# EasyEDA Pro project 差分放大器AD8138.eprj

# Schematic Schematic2
Board Name: AD8138; Create Date: 2025-05-21; Page Name: P1; Project Name: 差分放大器; Schematic Name: Schematic2; Update Date: 2025-05-21; Company: 嘉立创EDA; Page Size: A4; Version: V1.0
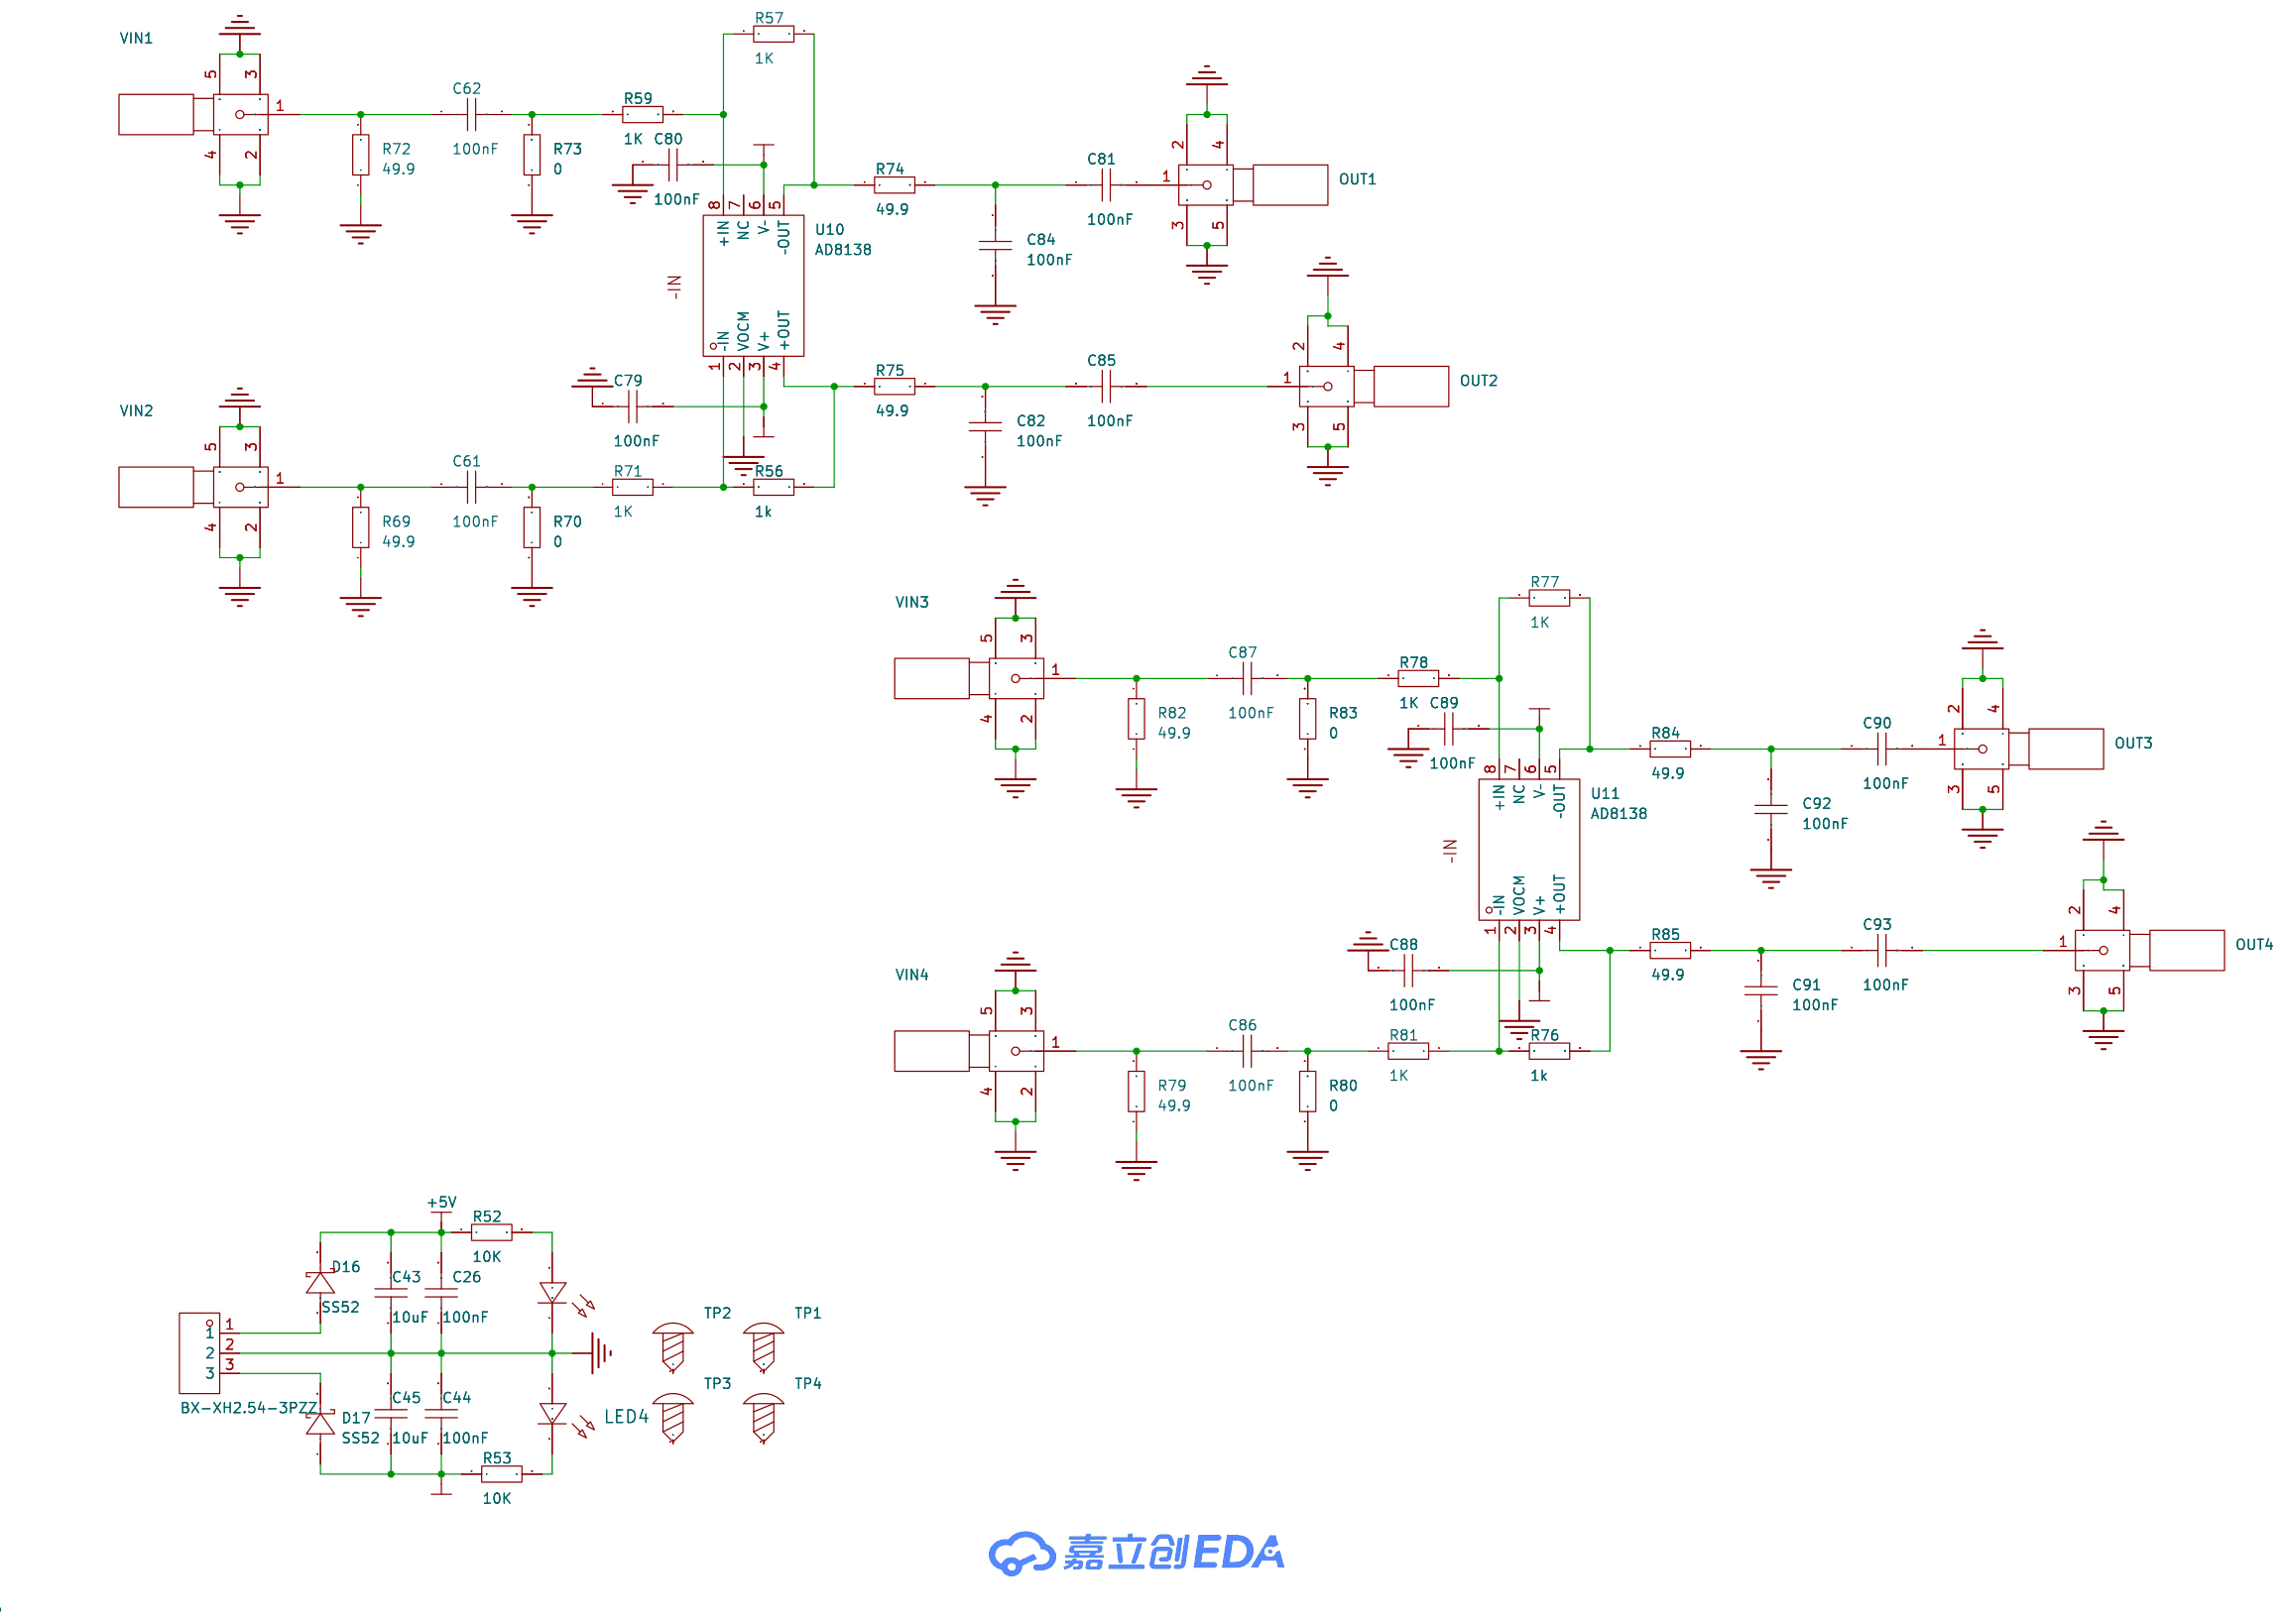
[diagram p0: schematic sheet]

## Parts
C26  100nF  [C0603]
C43  10uF  [C0603]
C44  100nF  [C0603]
C45  10uF  [C0603]
C61  100nF  [C0603]
C62  100nF  [C0603]
C79  100nF  [C0603]
C80  100nF  [C0603]
C81  100nF  [C0603]
C82  100nF  [C0603]
C84  100nF  [C0603]
C85  100nF  [C0603]
C86  100nF  [C0603]
C87  100nF  [C0603]
C88  100nF  [C0603]
C89  100nF  [C0603]
C90  100nF  [C0603]
C91  100nF  [C0603]
C92  100nF  [C0603]
C93  100nF  [C0603]
D16  SS52  [SMA_L4.3-W2.6-LS5.1-R-RD]
D17  SS52  [SMA_L4.3-W2.6-LS5.1-R-RD]
LED3  -  [LED_0603]
LED4  -  [LED_0603]
OUT1  被测信号  [SMA-SMD_SMA-KE]
OUT2  被测信号  [SMA-SMD_SMA-KE]
OUT3  被测信号  [SMA-SMD_SMA-KE]
OUT4  被测信号  [SMA-SMD_SMA-KE]
R52  10K  [R0603]
R53  10K  [R0603]
R56  1k  [R0603]
R57  1K  [R0603]
R59  1K  [R0603]
R69  49.9  [R0603]
R70  0  [R0603]
R71  1K  [R0603]
R72  49.9  [R0603]
R73  0  [R0603]
R74  49.9  [R0603]
R75  49.9  [R0603]
R76  1k  [R0603]
R77  1K  [R0603]
R78  1K  [R0603]
R79  49.9  [R0603]
R80  0  [R0603]
R81  1K  [R0603]
R82  49.9  [R0603]
R83  0  [R0603]
R84  49.9  [R0603]
R85  49.9  [R0603]
TP1  -  [M2螺丝]
TP2  -  [M2螺丝]
TP3  -  [M2螺丝]
TP4  -  [M2螺丝]
U3  BX-XH2.54-3PZZ  [CONN-TH_3P-P2.50_BX-XH2.54-3PZZ]
U10  AD8138  [SOIC-8_L4.9-W3.9-P1.27-LS6.0-BL]
U11  AD8138  [SOIC-8_L4.9-W3.9-P1.27-LS6.0-BL]
VIN1  被测信号  [SMA-SMD_SMA-KE]
VIN2  被测信号  [SMA-SMD_SMA-KE]
VIN3  被测信号  [SMA-SMD_SMA-KE]
VIN4  被测信号  [SMA-SMD_SMA-KE]

## Library data of the parts
C26 C43-C45 C61 C62 C79-C82 C84-C93 = CAP_0603: Supplier Footprint: 0603
D16 D17 = SS52: 二极管配置:独立式;正向压降(Vf):550mV@5A;直流反向耐压(Vr):20V;平均整流电流(Io):5A;; LCSC Part Name: 电压:20V 电流:5A; Supplier Part: C727064; Manufacturer: TWGMC(台湾迪嘉); Supplier Footprint: SMA(DO-214AC); JLCPCB Part Class: 扩展库; Datasheet: https://atta.szlcsc.com/upload/public/pdf/source/20200828/C727064_BD0A2B36CBC76CEA4B6710C57718D41F.pdf; Supplier: LCSC; Diode Configuration: 独立式; Forward Voltage (Vf@If): 550mV@5A; Reverse Voltage (Vr): 20V; Average Rectified Current (Io): 5A; Reverse Leakage Current (Ir): 500uA@20V
LED3 LED4 = LED_0603-R: Supplier Footprint: 0603
OUT1-OUT4 VIN1-VIN4 = SMA-KE_C9900004802: LCSC Part Name: SMA-KE; Supplier Part: C9900004802; Supplier Footprint: SMA-Hole-2Pin; JLCPCB Part Class: 扩展库; Supplier: LCSC
R52 R53 R56 R57 R59 R69-R85 = Res_0603: Supplier Footprint: 0603
TP1-TP4 = M2螺丝: Supplier Footprint: 插件
U3 = BX-XH2.54-3PZZ: 插针结构:1x3P;间距:2.54mm;安装方式:直插;参考系列:XH;总PIN数:3P;排数:1;每排PIN数:3;行距:-;额定电流:3A;触头材质:黄铜;触头镀层:锡;工作温度范围:-25℃~+85℃;; Supplier Part: C18077834; Manufacturer: Bossie(博锡); Supplier Footprint: 插件,P=2.54mm; JLCPCB Part Class: 扩展库; Datasheet: https://atta.szlcsc.com/upload/public/pdf/source/20231017/BF89167887E1F965B2791D14EC788A09.pdf; Supplier: LCSC; Pins Structure: 1x3P; Pitch: 2.54mm; Mounting Style: 直插; Reference Series: XH; Number of Pins: 3P; Number of Rows: 1; Number of PINs Per Row: 3; Current Rating (Max): 3A; Contact Material: 黄铜; Contact Plating: 锡; Operating Temperature Range: -25℃~+85℃
U10 U11 = AD8138: Supplier Part: C9900003414; Supplier Footprint: SOIC-8; JLCPCB Part Class: 扩展库; Supplier: LCSC

## Nets
+5V: C26.2 C43.2 C79.2 C88.2 D16.2(K) R52.1 U10.3(V+) U11.3(V+)
-5V: C44.1 C45.1 C80.2 C89.2 D17.1(A) R53.1 U10.6(V–) U11.6(V–)
GND: C26.1 C43.1 C44.2 C45.2 C79.1 C80.1 C82.1 C84.2 C88.1 C89.1 C91.1 C92.2 LED3.1(C) LED4.2(A) OUT1.2 OUT1.3 OUT1.4 OUT1.5 OUT2.2 OUT2.3 OUT2.4 OUT2.5 OUT3.2 OUT3.3 OUT3.4 OUT3.5 OUT4.2 OUT4.3 OUT4.4 OUT4.5 R69.1 R70.1 R72.1 R73.1 R79.1 R80.1 R82.1 R83.1 U3.2 U10.2(VOCM) U11.2(VOCM) VIN1.2 VIN1.3 VIN1.4 VIN1.5 VIN2.2 VIN2.3 VIN2.4 VIN2.5 VIN3.2 VIN3.3 VIN3.4 VIN3.5 VIN4.2 VIN4.3 VIN4.4 VIN4.5
$1N474: LED4.1(C) R53.2
$1N476: D16.1(A) U3.1
$1N477: D17.2(K) U3.3
$1N479: LED3.2(A) R52.2
$1N1070: C62.2 R59.1 R73.2
$1N1071: C62.1 R72.2 VIN1.1
$1N1075: C61.1 R69.2 VIN2.1
$1N1077: C61.2 R70.2 R71.1
$1N1082: R57.1 R59.2 U10.8(+IN)
$1N1085: R56.1 R71.2 U10.1(–IN)
$1N1088: R57.2 R74.1 U10.5(–OUT)
$1N1090: R56.2 R75.1 U10.4(+OUT)
$1N1450: C81.1 C84.1 R74.2
$1N1458: C82.2 C85.1 R75.2
$1N1560: C81.2 OUT1.1
$1N1714: C85.2 OUT2.1
$1N2634: C90.2 OUT3.1
$1N2638: C93.2 OUT4.1
$1N2641: R77.2 R84.1 U11.5(–OUT)
$1N2642: R77.1 R78.2 U11.8(+IN)
$1N2646: C91.2 C93.1 R85.2
$1N2651: C90.1 C92.1 R84.2
$1N2656: C86.1 R79.2 VIN4.1
$1N2658: C86.2 R80.2 R81.1
$1N2659: C87.2 R78.1 R83.2
$1N2660: C87.1 R82.2 VIN3.1
$1N2661: R76.1 R81.2 U11.1(–IN)
$1N2662: R76.2 R85.1 U11.4(+OUT)

Not connected (* = marked no-connect by the designer): TP1 1; TP2 1; TP3 1; TP4 1; U10 7(NC); U11 7(NC)

# Board PCB2
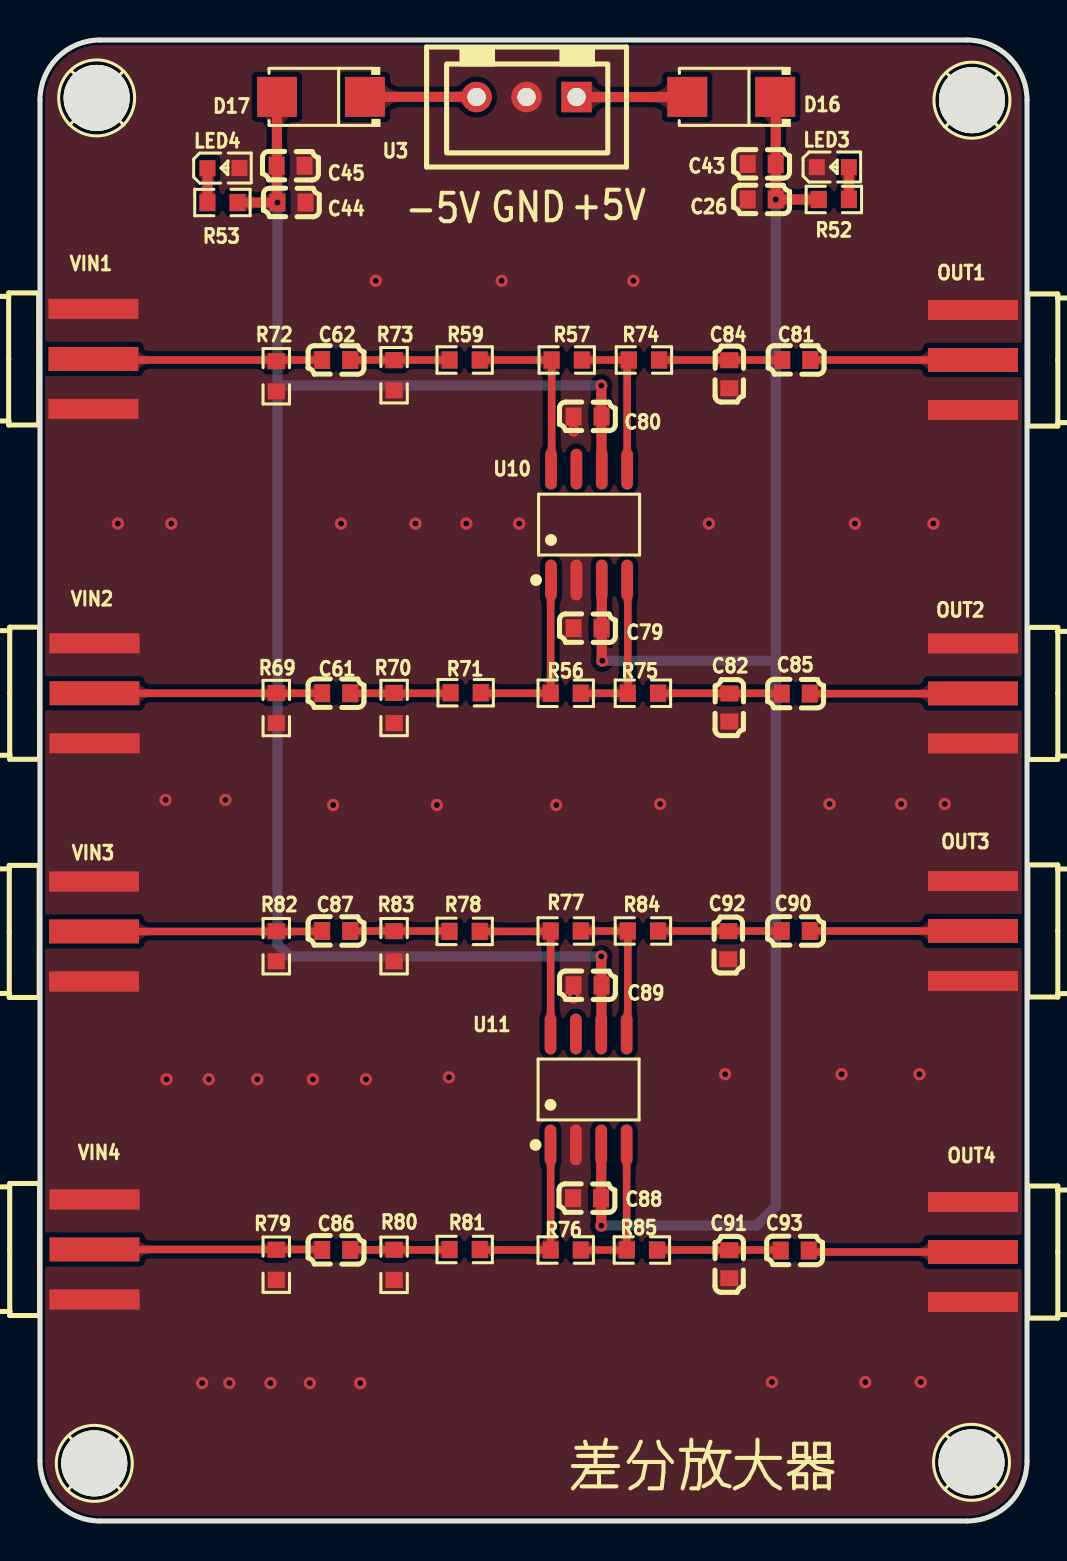
[diagram p1: board, top side]
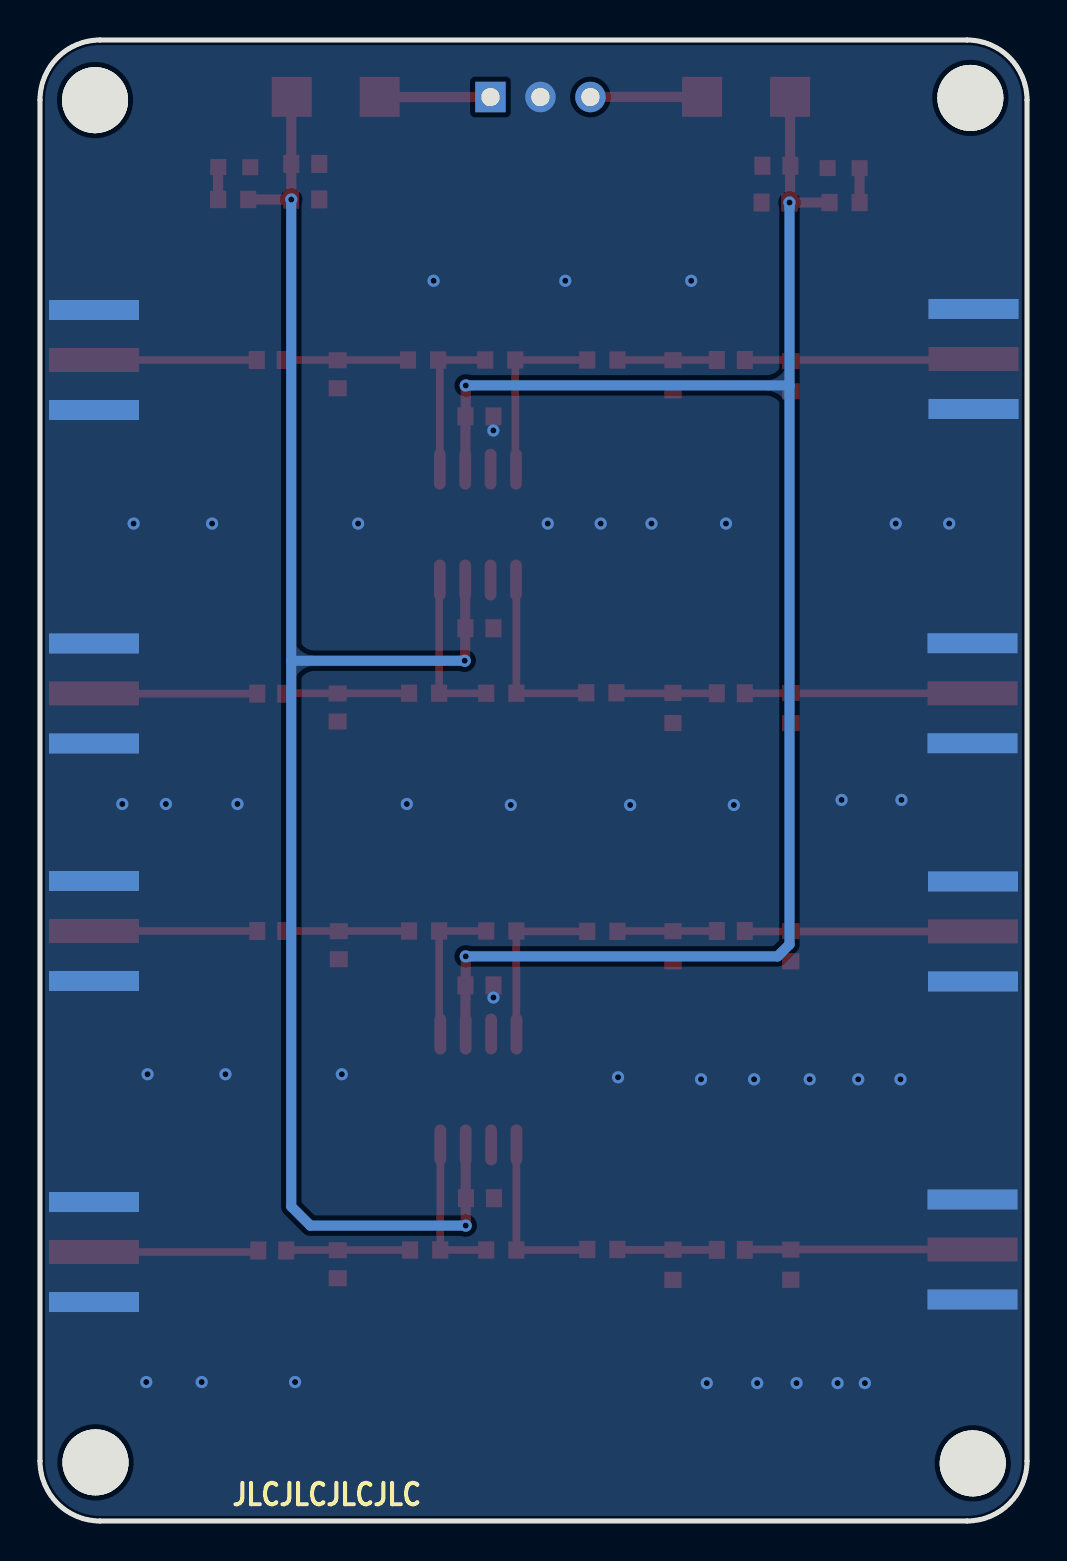
[diagram p2: board, bottom side, seen from below]

Outline 49.37 x 74.05 mm; copper layers: Top Layer, Bottom Layer. Coordinates in mm from the lower left corner of the outline.
Outline path: 0,71.05 0,3 arc(0.88,0.88) 3,0 46.37,0 arc(48.49,0.88) 49.37,3 49.37,71.05 arc(48.49,73.17) 46.37,74.05 3,74.05 arc(0.88,73.17) 0,71.05
Stack: Top Layer 0.035mm / Dielectric1 1.51mm FR4 er 4.5 / Bottom Layer 0.035mm

## Design rules (mm)
net $1N1085: DP1
net $1N1082: DP1
net $1N2661: DP2
net $1N2642: DP2
template: 自定义配置
spacing copperThickness1oz (default): track to track 0.102, other pairs 0.152 to 0.3
spacing copperThickness2oz: track to track 0.203, other pairs 0.152 to 0.3
track width copperThickness1oz (default): min 0.127, default 0.254, max 2.54
track width copperThickness2oz: min 0.203, default 0.254, max 2.54
differential pair differentialPair (default): width min 0.127, default 0.254, max 2.54; gap min 0.152, default 0.152
via viaSize (default): diameter min 0.5, default 0.61, max 10; hole min 0.3, default 0.305, max 6.3

## Placement (name value [footprint] x y rotation side)
C26  100nF  [C0603]  36.1 66.08 0 top
C43  10uF  [C0603]  36.1 67.86 0 top
C44  100nF  [C0603]  12.58 65.93 0 top
C45  10uF  [C0603]  12.54 67.77 0 top
C61  100nF  [C0603]  14.82 41.39 0 top
C62  100nF  [C0603]  14.82 58.05 0 top
C79  100nF  [C0603]  27.39 44.64 0 top
C80  100nF  [C0603]  27.39 55.23 0 top
C81  100nF  [C0603]  37.83 58.05 0 top
C82  100nF  [C0603]  34.48 40.68 90 top
C84  100nF  [C0603]  34.48 57.34 270 top
C85  100nF  [C0603]  37.8 41.37 0 top
C86  100nF  [C0603]  14.82 13.56 0 top
C87  100nF  [C0603]  14.82 29.5 0 top
C88  100nF  [C0603]  27.36 16.14 0 top
C89  100nF  [C0603]  27.39 26.78 0 top
C90  100nF  [C0603]  37.8 29.5 0 top
C91  100nF  [C0603]  34.48 12.84 90 top
C92  100nF  [C0603]  34.42 28.79 270 top
C93  100nF  [C0603]  37.75 13.53 0 top
D16  SS52  [SMA_L4.3-W2.6-LS5.1-R-RD]  34.58 71.21 180 top
D17  SS52  [SMA_L4.3-W2.6-LS5.1-R-RD]  14.05 71.21 180 top
LED3  -  [LED_0603]  39.71 67.7 0 top
LED4  -  [LED_0603]  9.23 67.65 0 top
OUT1  被测信号  [SMA-SMD_SMA-KE]  46.67 58.05 270 top
OUT2  被测信号  [SMA-SMD_SMA-KE]  46.67 41.38 270 top
OUT3  被测信号  [SMA-SMD_SMA-KE]  46.67 29.5 270 top
OUT4  被测信号  [SMA-SMD_SMA-KE]  46.67 13.45 270 top
R52  10K  [R0603]  39.71 66.08 0 top
R53  10K  [R0603]  9.13 65.93 180 top
R56  1k  [R0603]  26.3 41.39 0 top
R57  1K  [R0603]  26.35 58.05 0 top
R59  1K  [R0603]  21.24 58.05 0 top
R69  49.9  [R0603]  11.82 40.65 90 top
R70  0  [R0603]  17.71 40.65 90 top
R71  1K  [R0603]  21.29 41.42 0 top
R72  49.9  [R0603]  11.82 57.24 90 top
R73  0  [R0603]  17.71 57.29 90 top
R74  49.9  [R0603]  30.21 58.05 0 top
R75  49.9  [R0603]  30.16 41.39 0 top
R76  1k  [R0603]  26.3 13.55 0 top
R77  1K  [R0603]  26.3 29.5 0 top
R78  1K  [R0603]  21.24 29.48 0 top
R79  49.9  [R0603]  11.82 12.81 90 top
R80  0  [R0603]  17.71 12.81 90 top
R81  1K  [R0603]  21.24 13.58 0 top
R82  49.9  [R0603]  11.82 28.74 90 top
R83  0  [R0603]  17.71 28.74 90 top
R84  49.9  [R0603]  30.16 29.5 0 top
R85  49.9  [R0603]  30.11 13.55 0 top
TP1  -  [M2螺丝]  46.59 2.93 0 top
TP2  -  [M2螺丝]  2.72 2.88 0 top
TP3  -  [M2螺丝]  46.61 71.04 0 top
TP4  -  [M2螺丝]  2.83 71.16 0 top
U3  BX-XH2.54-3PZZ  [CONN-TH_3P-P2.50_BX-XH2.54-3PZZ]  24.34 71.2 180 top
U10  AD8138  [SOIC-8_L4.9-W3.9-P1.27-LS6.0-BL]  27.46 49.82 0 top
U11  AD8138  [SOIC-8_L4.9-W3.9-P1.27-LS6.0-BL]  27.44 21.58 0 top
VIN1  被测信号  [SMA-SMD_SMA-KE]  2.67 58.1 90 top
VIN2  被测信号  [SMA-SMD_SMA-KE]  2.73 41.39 90 top
VIN3  被测信号  [SMA-SMD_SMA-KE]  2.7 29.48 90 top
VIN4  被测信号  [SMA-SMD_SMA-KE]  2.73 13.58 90 top

## Footprints (pads in the part's own frame, mm; a bottom-side part is the same pattern mirrored in y, then rotated)
C0603
  rect 0.8x0.9 smd: 1(-0.7,0) 2(0.7,0)
CONN-TH_3P-P2.50_BX-XH2.54-3PZZ
  rect 1.524x1.524 hole 0.914: 1(-2.5,0)
  round 1.524 hole 0.914: 2(0,0) 3(2.5,0)
LED_0603
  rect 0.8x0.8 smd: 1(-0.851,-0.01) 2(0.75,-0.005)
M2螺丝
  round 3.3 hole 3.3: 1(0,0)
R0603
  rect 0.806x0.864 smd: 1(-0.753,0) 2(0.753,0)
SMA-SMD_SMA-KE
  rect 1.2x4.5 smd: 1(0,0)
  rect 1x4.5 smd: 2(-2.5,0) 3(2.5,0)
  rect 1x4.5 smd far side: 4(-2.5,0) 5(2.5,0)
SMA_L4.3-W2.6-LS5.1-R-RD
  rect 2x2 smd: 1(2.2,0) 2(-2.2,0)
SOIC-8_L4.9-W3.9-P1.27-LS6.0-BL
  oval 0.588x2.045 smd: 1(-1.905,-2.772) 2(-0.635,-2.772) 3(0.635,-2.772) 4(1.905,-2.772) 5(1.905,2.772) 6(0.635,2.772) 7(-0.635,2.772) 8(-1.905,2.772)

## Nets
As in the schematic.

Pads without a net: TP1 1; TP2 1; TP3 1; TP4 1; U10 7; U11 7

## Via types
v1: diameter 0.61, hole 0.305, Top Layer to Bottom Layer, 46 vias

## Routing (per net, layer and track width the routed paths; a pad name or vN(x,y) marks a point on that pad's centre or on a via; arc(x,y) is an arc through that point)
+5V: length 83.5
  Top Layer w0.508: D16.2 36.8,71.19 C43.2 v1(36.8,66.08) R52.1 ; U10.3 28.1,43.04 v1(28.13,43.02) ; U11.3 v1(28.07,14.77)
  Bottom Layer w0.508: 36.8,43.02 v1(28.13,43.02) ; 36.8,43.02 36.8,15.72 35.85,14.77 v1(28.07,14.77) ; 36.8,43.02 v1(36.8,66.08)
-5V: length 85.1
  Top Layer w0.508: v1(28.07,56.78) 28.07,55.25 C80.2 28.09,52.61 U10.6 ; 11.85,71.21 11.85,65.95 v1(11.88,65.93) R53.1 ; U11.6 28.09,24.36 C89.2 28.07,26.8 v1(28.07,28.23)
  Bottom Layer w0.508: 11.88,56.78 28.07,56.78 v1(28.07,56.78) ; 11.88,56.78 v1(11.88,65.93) ; 11.88,56.78 11.88,28.83 12.48,28.23 v1(28.07,28.23)
GND:
  vias: v1(3.89,49.87) v1(6.28,36.06) v1(6.33,22.09) v1(6.57,49.87) v1(8.11,6.9) v1(8.44,22.09) v1(9.27,36.06) v1(9.47,6.9) v1(10.87,22.09) v1(11.53,6.9) v1(13.5,6.9) v1(13.65,22.09) v1(14.66,35.8) v1(15.06,49.87) v1(16.02,6.9) v1(16.31,22.09) v1(16.8,62.01) v1(18.78,49.87) v1(19.85,35.8) v1(20.45,22.19) v1(21.32,49.87) v1(23.09,62.01) v1(23.97,49.87) v1(25.82,35.8) v1(26.69,54.53) v1(26.69,26.18) v1(29.68,62.01) v1(31.02,35.85) v1(33.46,49.87) v1(34.27,22.34) v1(36.61,6.95) v1(39.49,35.85) v1(40.09,22.34) v1(40.76,49.87) v1(41.28,6.95) v1(43.07,35.85) v1(43.99,22.34) v1(44.05,6.95) v1(44.69,49.87) v1(45.25,35.85)
$1N474: length 1.7
  Top Layer w0.508: R53.2 8.38,65.93 LED4.1
$1N476: length 5.5
  Top Layer w0.508: D16.1 32.37,71.2 U3.1
$1N477: length 5.6
  Top Layer w0.508: U3.3 21.83,71.21 D17.2
$1N479: length 1.6
  Top Layer w0.508: R52.2 40.46,67.69 LED3.2
$1N1070: length 5
  Top Layer w0.381: C62.2 R59.1
$1N1071: length 11.4
  Top Layer w0.381: 2.67,58.05 14.11,58.05
$1N1075: length 11.4
  Top Layer w0.381: VIN2.1 C61.1
$1N1077: length 5
  Top Layer w0.381: C61.2 20.51,41.39 20.54,41.42
$1N1082: length 9.2
  Top Layer w0.381: R59.2 R57.1 25.59,52.63 U10.8 ; 25.59,58.1 25.59,58.26
$1N1085: length 9.2
  Top Layer w0.381: R71.2 22.07,41.39 R56.1 25.54,47.03 U10.1
$1N1088: length 7.8
  Top Layer w0.381: R57.2 R74.1 29.37,57.97 U10.5
$1N1090: length 8
  Top Layer w0.381: R56.2 R75.1 29.4,47.02 U10.4
$1N1450: length 6.2
  Top Layer w0.381: R74.2 C81.1
$1N1458: length 6.2
  Top Layer w0.381: R75.2 37.08,41.39 C85.1
$1N1560: length 8.1
  Top Layer w0.381: C81.2 OUT1.1
$1N1714: length 8.2
  Top Layer w0.381: OUT2.1 46.66,41.37 C85.2
$1N2634: length 8.2
  Top Layer w0.381: C90.2 OUT3.1
$1N2638: length 8.2
  Top Layer w0.381: OUT4.1 38.53,13.45 C93.2
$1N2641: length 7.5
  Top Layer w0.381: R77.2 R84.1 29.4,24.41 U11.5
$1N2642: length 8.7
  Top Layer w0.381: U11.8 25.54,24.36 R77.1 25.52,29.48 R78.2
$1N2646: length 6.2
  Top Layer w0.381: R85.2 37.03,13.55 C93.1
$1N2651: length 6.2
  Top Layer w0.381: R84.2 C90.1
$1N2656: length 11.4
  Top Layer w0.381: VIN4.1 14.09,13.58 C86.1
$1N2658: length 5
  Top Layer w0.381: C86.2 20.47,13.56 R81.1
$1N2659: length 5
  Top Layer w0.381: R78.1 20.47,29.5 C87.2
$1N2660: length 11.4
  Top Layer w0.381: 2.7,29.48 14.09,29.48 C87.1
$1N2661: length 8.8
  Top Layer w0.381: R81.2 22.02,13.55 R76.1 25.54,18.8 U11.1
$1N2662: length 7.6
  Top Layer w0.381: R76.2 R85.1 29.34,13.56 U11.4

## Copper pours and planes (outline as drawn; the poured copper is in the pictures)
GND on Top Layer: -18.72,81.19 67.88,81.19 67.88,-9.28 -18.72,-9.28
GND on Bottom Layer: -18.56,81.5 68.04,81.5 68.04,-8.98 -18.56,-8.98

Small or netless copper shapes (teardrops, artwork), in the pictures only: 128 on Top Layer, 8 on Bottom Layer

## Text on the board
Bottom Silkscreen Layer: JLCJLCJLCJLC
Top Silkscreen Layer: -5V | GND | +5V | 差分放大器
